# EAGLE design DEC9601 (EAGLE 6.6.0)
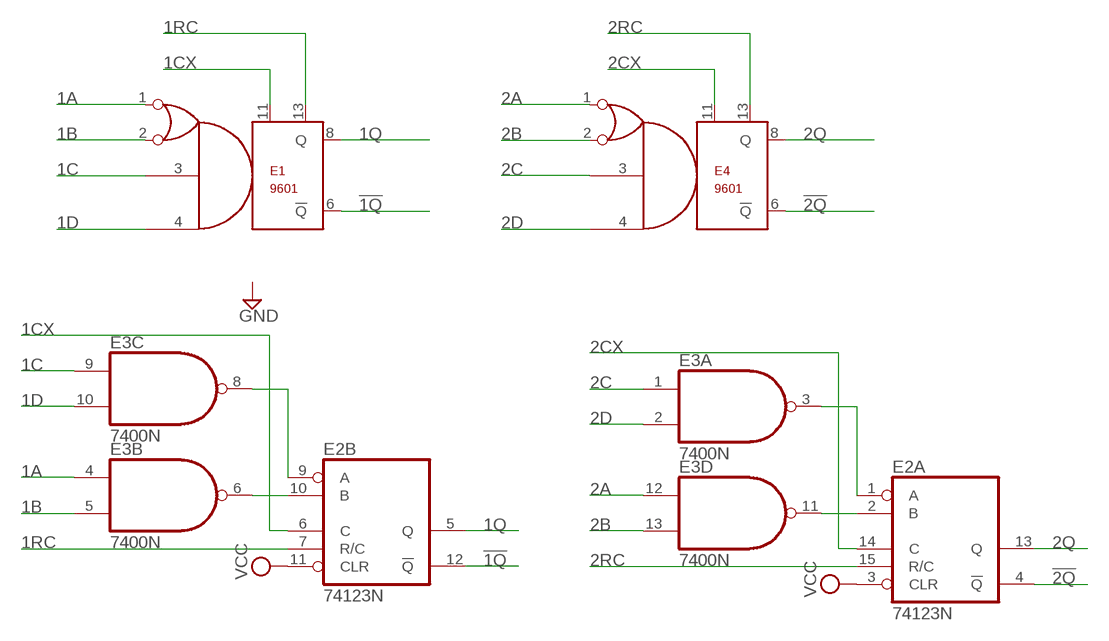
[diagram p0: schematic, sheet 1]

## Parts
E1  9601  [DIL14]
E2  74123N  [DIL16]
E3  7400N  [DIL14]
E4  9601  [DIL14]

## Nets
1A: E1.1 E3.4(B:I0)
1B: E1.2 E3.5(B:I1)
1C: E1.3 E3.9(C:I0)
1CX: E1.11 E2.6(B:C)
1D: E1.4 E3.10(C:I1)
1Q: E1.8(Q) E2.5(B:Q)
1RC: E1.13 E2.7(B:R/C)
2A: E3.12(D:I0) E4.1
2B: E3.13(D:I1) E4.2
2C: E3.1(A:I0) E4.3
2CX: E2.14(A:C) E4.11
2D: E3.2(A:I1) E4.4
2Q: E2.13(A:Q) E4.8(Q)
2RC: E2.15(A:R/C) E4.13
!1Q: E1.6(!Q) E2.12(B:!Q)
!2Q: E2.4(A:!Q) E4.6(!Q)
N$4: E2.10(B:B) E3.6(B:O)
N$6: E2.9(B:A) E3.8(C:O)
N$7: E2.1(A:A) E3.3(A:O)
N$8: E2.2(A:B) E3.11(D:O)
VCC [power]: E2.3(A:CLR) E2.11(B:CLR)

## Power pins joined to a net without a drawn wire
GND: E1.7(GND) E2.8(P:GND) E3.7(P:GND) E4.7(GND)
VCC: E1.14(VCC) E2.16(P:VCC) E3.14(P:VCC) E4.14(VCC)

## Library data of the parts
E1 E4 = dec-con:9601: DEC9601 monstable
E2 = 74xx-us:74*123: Retriggerable monostable MULTIVIBRATOR
E3 = 74xx-us:74*00: Quad 2-input NAND gate

## Board
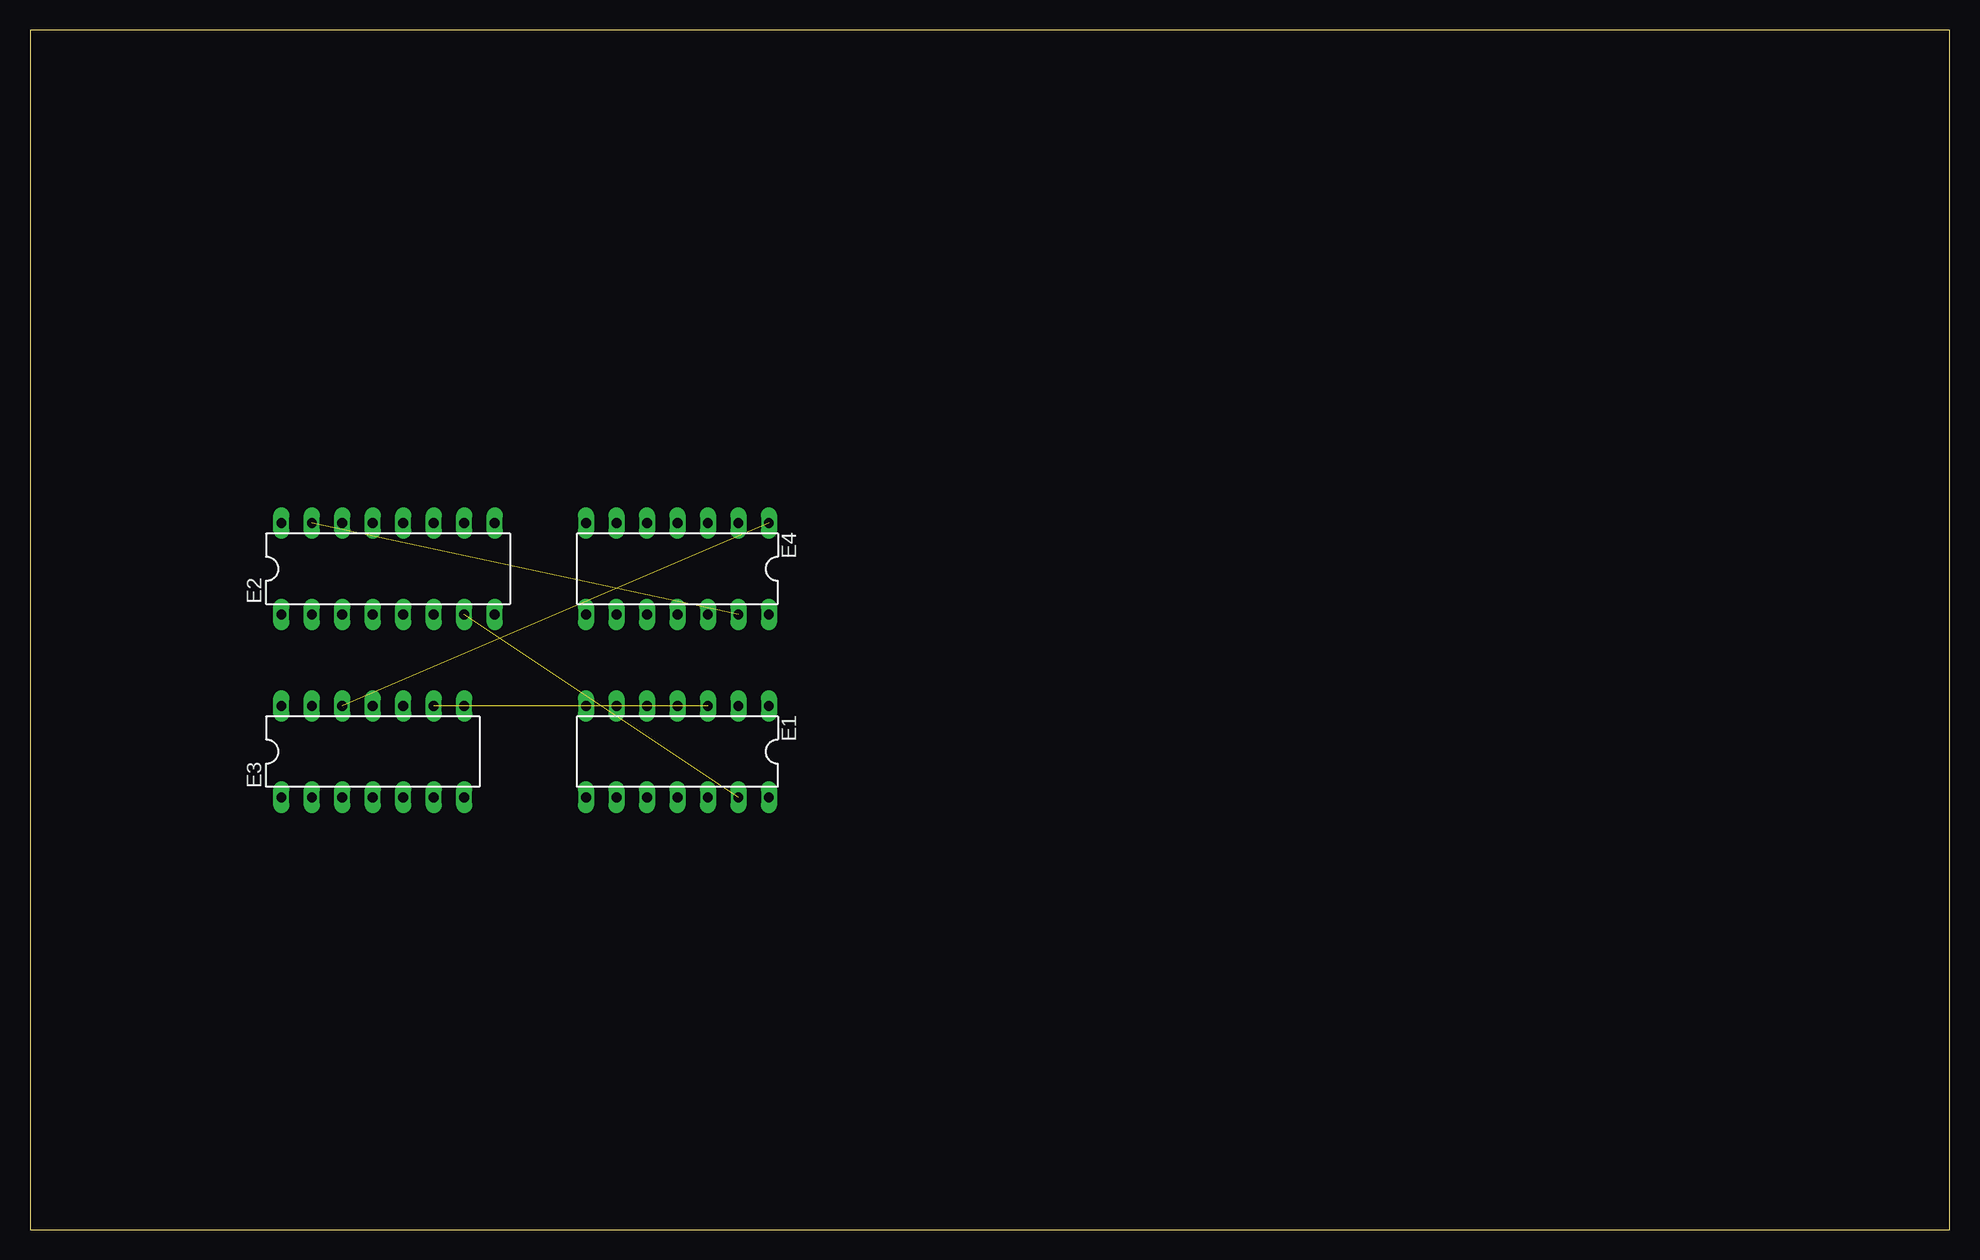
[diagram p1: board, top side]
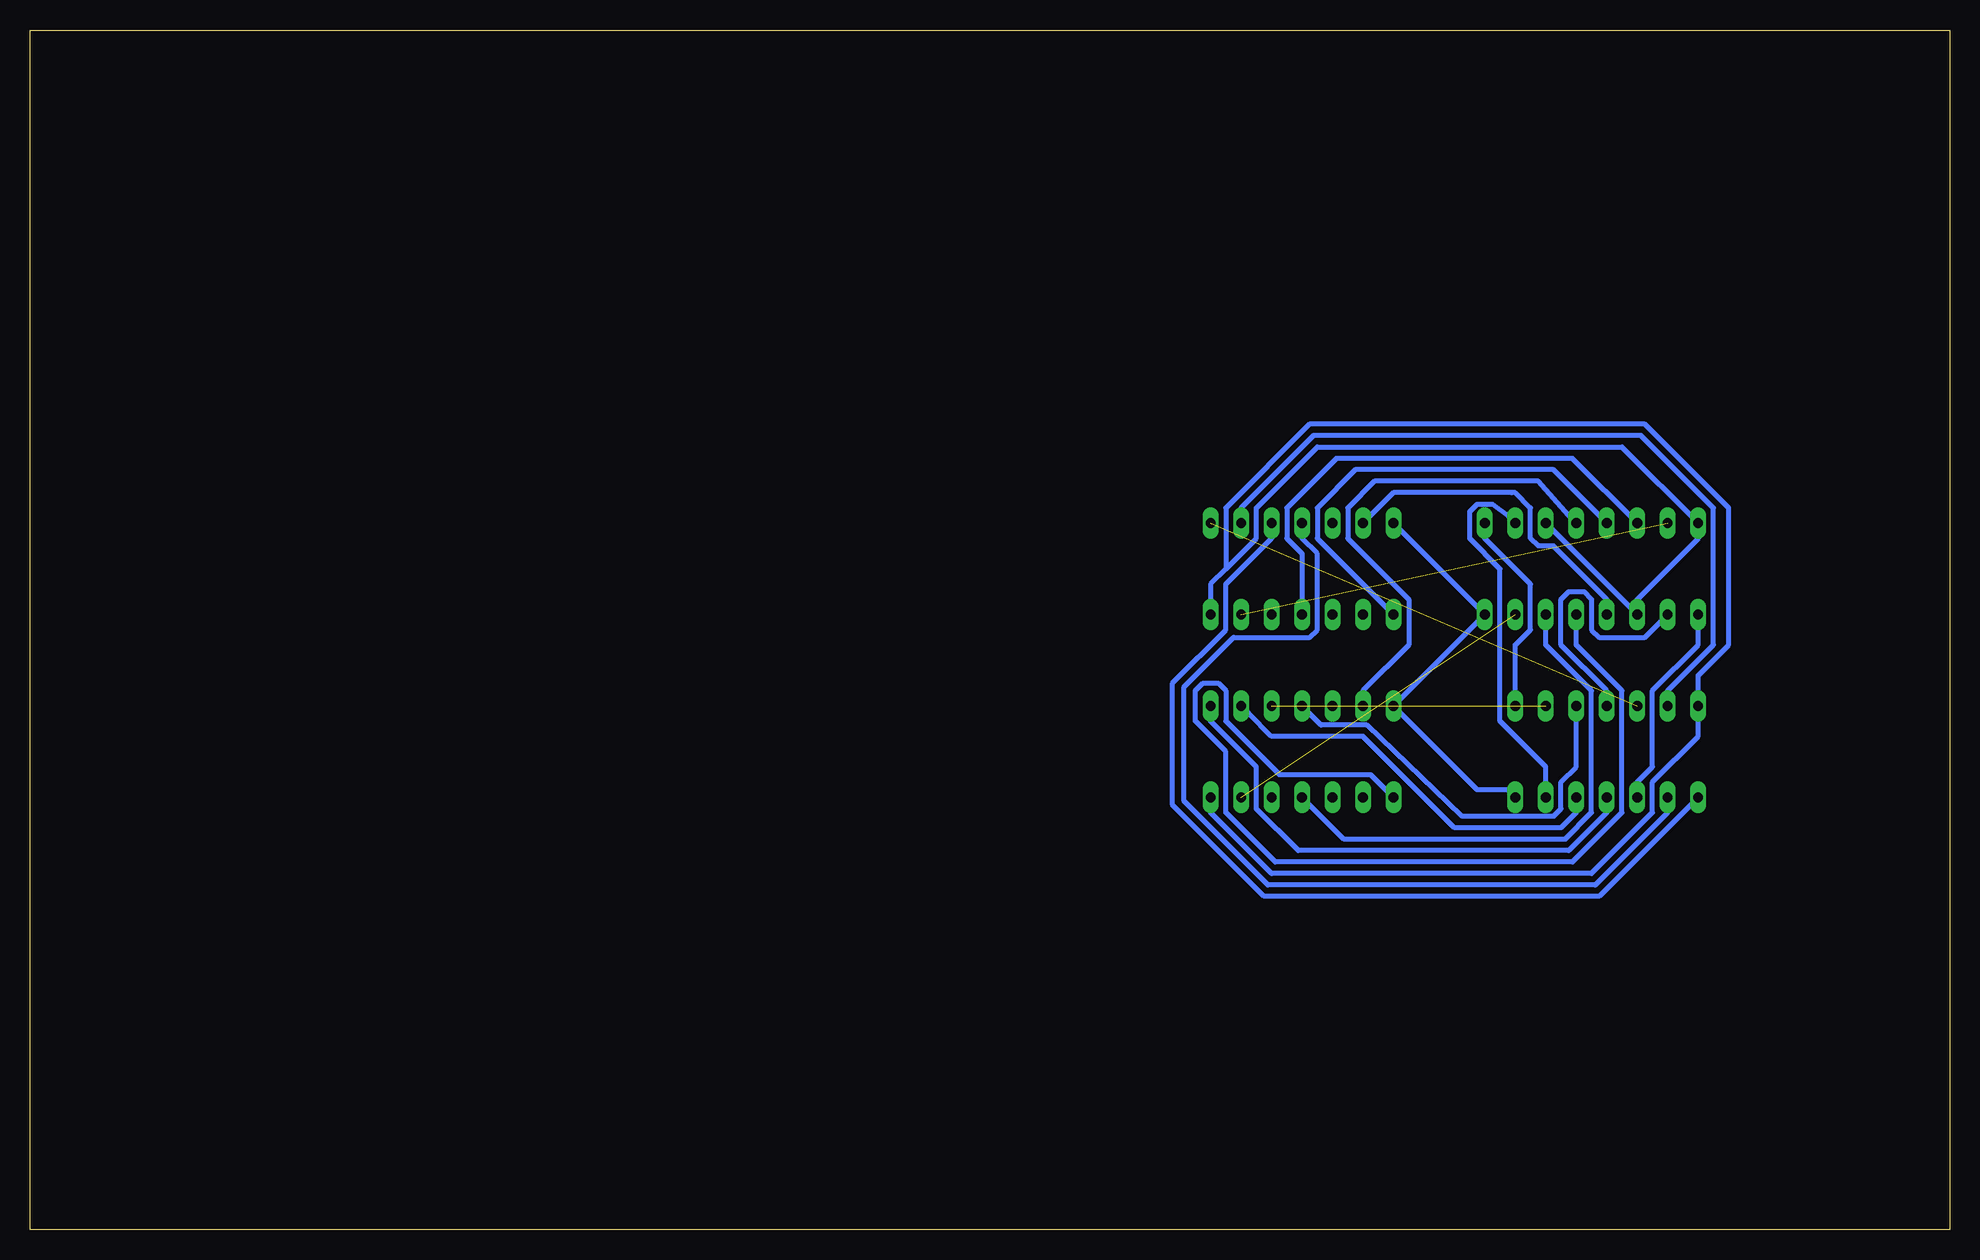
[diagram p2: board, bottom side, seen from below]

Size 160 x 100 mm. Coordinates in mm from the lower left corner, seen from the top.
Outline: 0,0 160,0 160,100 0,100 0,0
Copper layers (1+16): Top 0.035mm / dielectric 1.5mm / Bottom 0.035mm
Design rules "16mils": minimum track width 16mil, minimum drill 32mil, track to track 15mil, track to pad 10mil, pad to pad 10mil, via to via 10mil, smd to smd 10mil, copper to edge 13mil, drill to drill 10mil, minimum pad ring 10mil, minimum via ring 8mil, stop-mask expansion 0mil, vias tented up to drill 0mil, thermal gap 10mil

### Footprints (pad centres in the part's own frame; a part is rotated, then mirrored left to right if it is on the bottom)
DIL14 = drill 0.813 long: 1 -7.62,-3.81; 2 -5.08,-3.81; 3 -2.54,-3.81; 4 0,-3.81; 5 2.54,-3.81; 6 5.08,-3.81; 7 7.62,-3.81; 8 7.62,3.81; 9 5.08,3.81; 10 2.54,3.81; 11 0,3.81; 12 -2.54,3.81; 13 -5.08,3.81; 14 -7.62,3.81
DIL16 = drill 0.813 long: 1 -8.89,-3.81; 2 -6.35,-3.81; 3 -3.81,-3.81; 4 -1.27,-3.81; 5 1.27,-3.81; 6 3.81,-3.81; 7 6.35,-3.81; 8 8.89,-3.81; 9 8.89,3.81; 10 6.35,3.81; 11 3.81,3.81; 12 1.27,3.81; 13 -1.27,3.81; 14 -3.81,3.81; 15 -6.35,3.81; 16 -8.89,3.81

### Placement (x,y rotation side)
E1  53.97,39.84 180 top
E2  29.84,55.08 0 top
E3  28.57,39.84 0 top
E4  53.97,55.08 180 top

### Tracks (layer width: path | path; a pad name or v marks a point on that pad's centre or on a via)
1A
  Bottom 0.406: E3.4 28.57,34.76 31.74,31.58 54.29,31.58 57.78,35.08 57.78,38.57 61.59,42.38 E1.1
1B
  Bottom 0.406: E3.5 31.11,34.76 32.38,33.49 41.27,33.49 48.89,41.11 56.51,41.11 58.41,43.02 E1.2
1C  (1 unrouted)
1CX
  Bottom 0.406: E1.11 50.48,32.54 32.06,32.54 29.84,34.76 29.84,44.92 33.65,48.73 E2.6
1D
  Bottom 0.406: E3.10 31.11,38.57 32.38,37.3 32.38,35.08 33.02,34.44 40.64,34.44 48.57,42.06 52.38,42.06 E1.4
1Q
  Bottom 0.406: E1.8 48.26,37.94 55.88,37.94 60.32,42.38 60.32,44.92 60.96,45.55 62.23,45.55 62.86,44.92 62.86,42.38 60.32,39.84 60.32,34.76 56.19,30.63 31.43,30.63 27.3,34.76 27.3,44.92 31.11,48.73 E2.5
1RC  (1 unrouted)
2A  (1 unrouted)
2B
  Bottom 0.406: E3.13 23.49,44.92 19.68,48.73 19.68,60.16 25.71,66.19 53.02,66.19 59.05,60.16 E4.2
2C
  Bottom 0.406: E3.1 29.2,27.77 57.15,27.77 64.77,35.39 64.77,45.55 60.32,50 60.32,53.81 56.51,57.62 E4.3
2CX
  Bottom 0.406: E4.11 53.97,56.35 55.24,57.62 55.24,60.16 51.11,64.29 31.43,64.29 E2.14
2D
  Bottom 0.406: E3.2 23.49,34.76 29.52,28.73 56.83,28.73 63.81,35.71 63.81,45.24 59.69,49.37 53.34,49.37 52.7,50 52.7,56.35 53.97,57.62 E4.4
2Q
  Bottom 0.406: E2.13 33.02,63.34 49.53,63.34 52.7,60.16 52.7,57.62 E4.8
2RC  (1 unrouted)
!1Q
  Bottom 0.406: E2.12 31.74,59.52 34.29,62.38 47.94,62.38 50.16,60.16 50.16,57.62 45.08,52.54 45.08,48.73 48.89,44.92 E1.6
!2Q
  Bottom 0.406: E2.4 28.57,52.54 33.02,56.98 34.29,56.98 34.92,57.62 34.92,60.16 36.19,61.43 36.51,61.43 46.35,61.43 48.26,59.52 E4.6
GND
  Bottom 0.406: E3.7 36.83,36.66 39.37,36.66 45.72,43.02 E1.7 45.72,44.28 39.37,50.63 E2.8 39.37,51.91 45.72,58.25 E4.7
N$4
  Bottom 0.406: E3.6 33.65,38.57 37.46,42.38 37.46,55.08 40,57.62 40,59.84 39.37,60.48 38.1,60.48 36.83,59.52 E2.10
N$6
  Bottom 0.406: E3.8 36.19,44.92 36.19,48.73 34.92,50 34.92,53.81 38.73,57.62 E2.9
N$7
  Bottom 0.406: E2.1 20.95,50 20.95,48.73 24.76,44.92 24.76,38.57 26.03,37.3 E3.3
N$8
  Bottom 0.406: E3.11 28.57,44.92 32.38,48.73 32.38,52.54 31.74,53.17 30.47,53.17 29.84,52.54 29.84,50 29.2,49.37 25.39,49.37 24.12,50.63 E2.2
VCC
  Bottom 0.406: E1.14 61.59,34.76 56.51,29.68 29.84,29.68 24.76,34.76 24.76,37.3 20.95,41.11 E3.14 20.95,46.19 18.41,48.73 18.41,60.16 25.39,67.14 53.34,67.14 60.32,60.16 60.32,55.08 | 60.32,55.08 57.78,57.62 57.78,60.16 52.7,65.24 27.3,65.24 E2.16 20.95,57.62 26.03,52.54 E2.3 E2.11 | 60.32,55.08 61.59,53.81 E4.14